# Altium schematic sheet shield-led.SchDoc
size A; PageSetup: Record=PageOptions|CenterHorizontal=True|CenterVertical=True|PrintScale=1.11|XCorrection=1.00|YCorrection=1.00|PrintKind=0|BorderSize=5000000|LeftOffset=0|BottomOffset=0|Orientation=2|PaperLength=1000|PaperWidth=1000|Scale=100|PaperSource=7|PrintQuality=-3|MediaType=1|DitherType=10|PrintScaleMode=1|PaperKind=Letter|PaperIndex=1
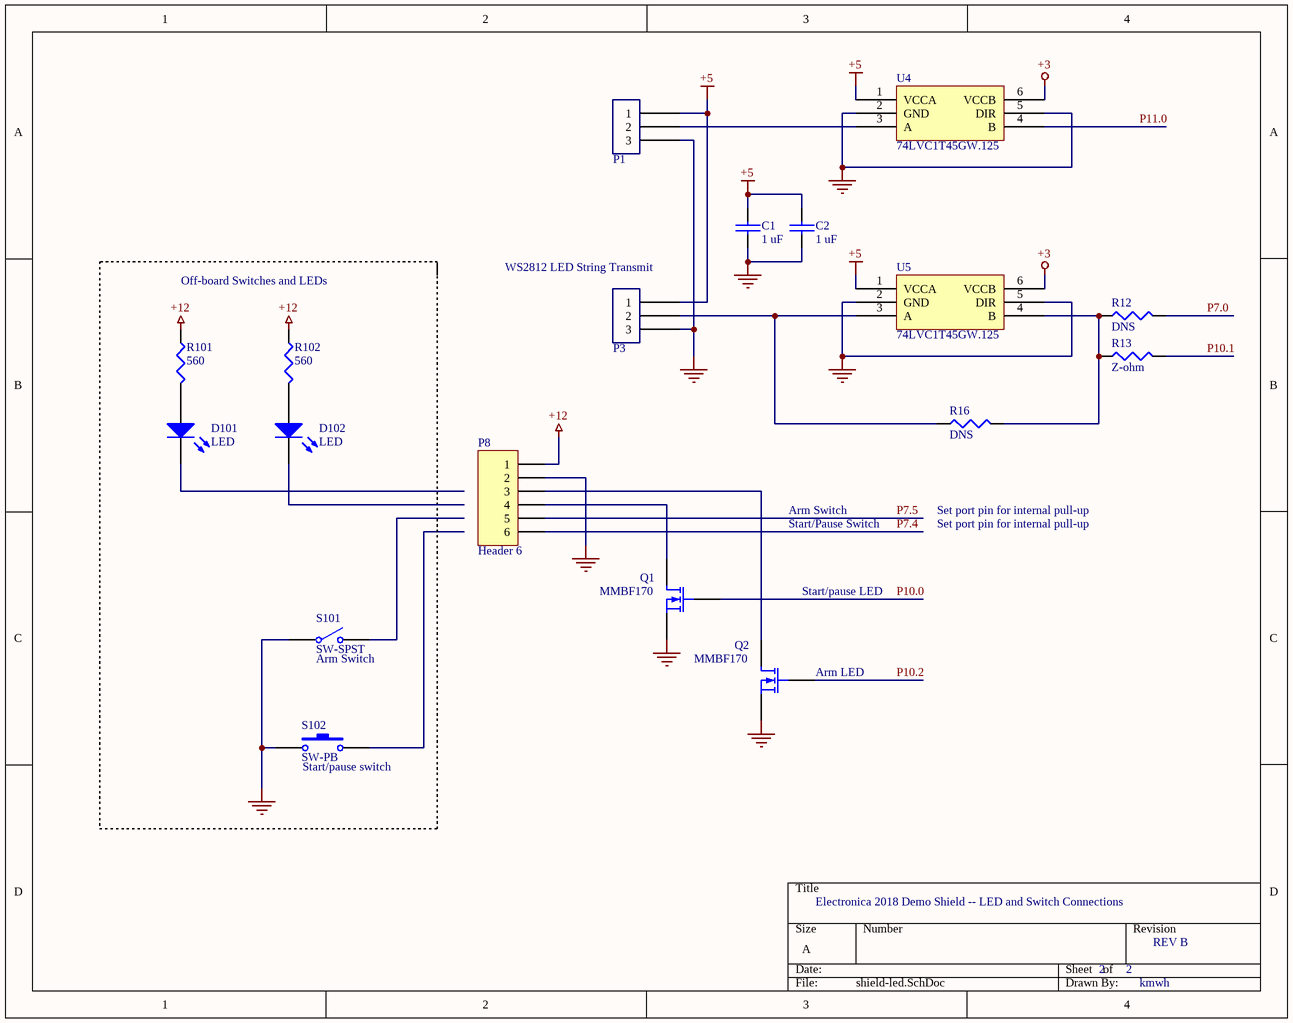
[diagram p0: shield-led.SchDoc]

## Parts
C1  1 uF  [C0805]
C2  1 uF  [C0805]
D101  LED  [3216[1206]]
D102  LED  [3216[1206]]
P1  Connector, 0.138", 3  [connector-0.138-3pin]  (value not drawn)
P3  Connector, 0.138", 3  [connector-0.138-3pin]  (value not drawn)
P8  Header 6  [HDR1X6]
Q1  MMBF170  [SOT23]
Q2  MMBF170  [SOT23]
R12  DNS  [R0603]
R13  Z-ohm  [R0603]
R16  DNS  [R0603]
R101  560  [R0603]
R102  560  [R0603]
S101  SW-SPST  [SPST-2]
S102  SW-PB  [SPST-2]
U4  74LVC1T45GW.125  [SOT363]
U5  74LVC1T45GW.125  [SOT363]

## Nets
+3: U4.6(VCCB) U5.6(VCCB)
+5: C1.1(A) C2.1(A) P1.1 P3.1 U4.1(VCCA) U5.1(VCCA)
+12: P8.1 R101.1(A) R102.1(A)
GND: C1.2(B) C2.2(B) P1.3 P3.3 P8.2 Q1.2(S) Q2.2(S) S101.1(COMMON) S102.1 U4.2(GND) U4.5(DIR) U5.2(GND) U5.5(DIR)
P7.0: R12.2(B)
P7.4: P8.6
P7.5: P8.5
P10.0: Q1.1(G)
P10.1: R13.2(B)
P10.2: Q2.1(G)
P11.0: U4.4(B)
NetD101_1: D101.1(A) R101.2(B)
NetD102_1: D102.1(A) R102.2(B)
NetP1_2: P1.2 U4.3(A)
NetP3_2: P3.2 R16.1(A) U5.3(A)
NetP8_3: P8.3 Q2.3(D)
NetP8_4: P8.4 Q1.3(D)
NetR12_1: R12.1(A) R13.1(A) R16.2(B) U5.4(B)

Not connected (* = marked no-connect by the designer): D101 2(K); D102 2(K); S101 2(NO); S102 2

## Notes on the sheet
- Off-board Switches and LEDs
- (near P3) WS2812 LED String Transmit
- Start/Pause Switch
- Arm Switch
- Set port pin for internal pull-up
- Start/pause LED
- (near S101) Arm Switch
- (near Q2) Arm LED
- (near S102) Start/pause switch
- Electronica 2018 Demo Shield -- LED and Switch Connections
- 2
- REV B
- kmwh

## Library data of the parts
C1 C2 = CAP, CER, 1UF, 0805: CAP, CER, 1UF, 16v, 10%, X5R, 0805; VENDOR: Digikey; VALUE: 1 uF
D101 D102 = LED 1206: Published: 8-Jun-2000; LatestRevisionDate: 17-Jul-2002; LatestRevisionNote: Re-released for DXP Platform.; PackageVersion: Feb-2002; PackageReference: 3.2X1.6X1.1; Publisher: Altium Limited
P1 P3 = Connector, 0.138", 3: Connector, 0.138", 3 pin
P8 = Header 6: Header, 6-Pin; LatestRevisionDate: 17-Jul-2002; LatestRevisionNote: Re-released for DXP Platform.; Publisher: Altium Limited
Q1 Q2 = MMBF170-7-F: VENDOR_PN: MMBF170-FDICT-ND; VENDOR: Digikey; VALUE: MMBF170; VENDOR_LINK: https://www.digikey.com/products/en?keywords=MMBF170-FDICT-ND
R12 R13 R16 R101 R102 = RES, BLANK, 0603: RES, BLANK OHM, 1/10W, 1%, 0603 SMD; VENDOR: Digikey
  R12 R16: VALUE: DNS
  R13: VALUE: Z-ohm
  R101 R102: VALUE: 560
S101 = SW-SPST: Single-Pole, Single-Throw Switch; Published: 24-Mar-1999; LatestRevisionDate: 17-Jul-2002; LatestRevisionNote: Re-released for DXP Platform.; PackageReference: SPST-2; Publisher: Altium Limited; PackageDescription: Switch; 2 Leads
S102 = SW-PB: Switch; Published: 24-Mar-1999; LatestRevisionDate: 17-Jul-2002; LatestRevisionNote: Re-released for DXP Platform.; PackageReference: SPST-2; Publisher: Altium Limited; PackageDescription: Switch; 2 Leads
U4 U5 = 74LVC1T45: VENDOR: Digikey; VENDOR_PN: 1727-4560; MFG: Nexperia; MFG_PN: 74LVC1T45GW,125; VENDOR_LINK: https://www.digikey.com/product-detail/en/nexperia-usa-inc/74LVC1T45GW125/1727-4560-1-ND/2530939; VALUE: 74LVC1T45GW.125; MFG_LINK: https://assets.nexperia.com/documents/data-sheet/74LVC_LVCH1T45.pdf